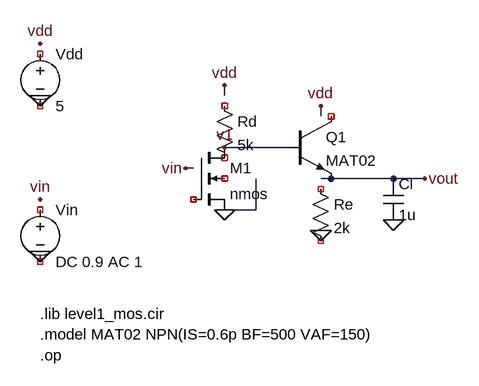
[diagram p0: schematic Assignment3_op_normal.asc]
Assignment3_op_normal.asc, the LTspice schematic file:
Version 4
SHEET 1 1140 800
WIRE 348 0 348 16
WIRE 496 32 496 48
WIRE 348 96 448 96
WIRE 288 128 300 128
WIRE 396 144 396 192
WIRE 348 192 396 192
WIRE 496 144 608 144
WIRE 608 144 656 144
FLAG 64 -64 vdd
FLAG 64 16 0
FLAG 64 176 vin
FLAG 64 256 0
FLAG 288 128 vin
FLAG 348 0 vdd
FLAG 496 32 vdd
FLAG 348 192 0
FLAG 496 224 0
FLAG 608 208 0
FLAG 656 144 vout
FLAG 348 96 v1
SYMBOL voltage 64 -64 R0
SYMATTR InstName Vdd
SYMATTR Value 5
SYMBOL voltage 64 176 R0
SYMATTR InstName Vin
SYMATTR Value DC 0.9 AC 1
SYMBOL res 332 16 R0
SYMATTR InstName Rd
SYMATTR Value 5k
SYMBOL nmos4 300 96 R0
SYMATTR InstName M1
SYMATTR Value nmos
SYMATTR Value2 l=1u w=100u
SYMBOL npn 448 48 R0
SYMATTR InstName Q1
SYMATTR Value MAT02
SYMBOL res 480 144 R0
SYMATTR InstName Re
SYMATTR Value 2k
SYMBOL cap 592 144 R0
SYMATTR InstName Cl
SYMATTR Value 1u
TEXT 64 352 Left 2 !.lib level1_mos.cir
TEXT 64 384 Left 2 !.model MAT02 NPN(IS=0.6p BF=500 VAF=150)
TEXT 64 416 Left 2 !.op

The netlist it stands for:
* Assignment3_op_normal.asc
Vdd NC_01 NC_02 5
Vin NC_03 NC_04 DC 0.9 AC 1
Rd NC_05 NC_06 5k
* M1: nmos l=1u w=100u (symbol nmos4 not certain, pin order unknown); nets seen at it: 0, v1
* Q1: MAT02 (symbol npn not certain, pin order unknown); nets seen at it: 0, v1, vout
Re NC_10 NC_11 2k
Cl vout 0 1u
.lib level1_mos.cir
.model MAT02 NPN(IS=0.6p BF=500 VAF=150)
.op
.backanno
.end